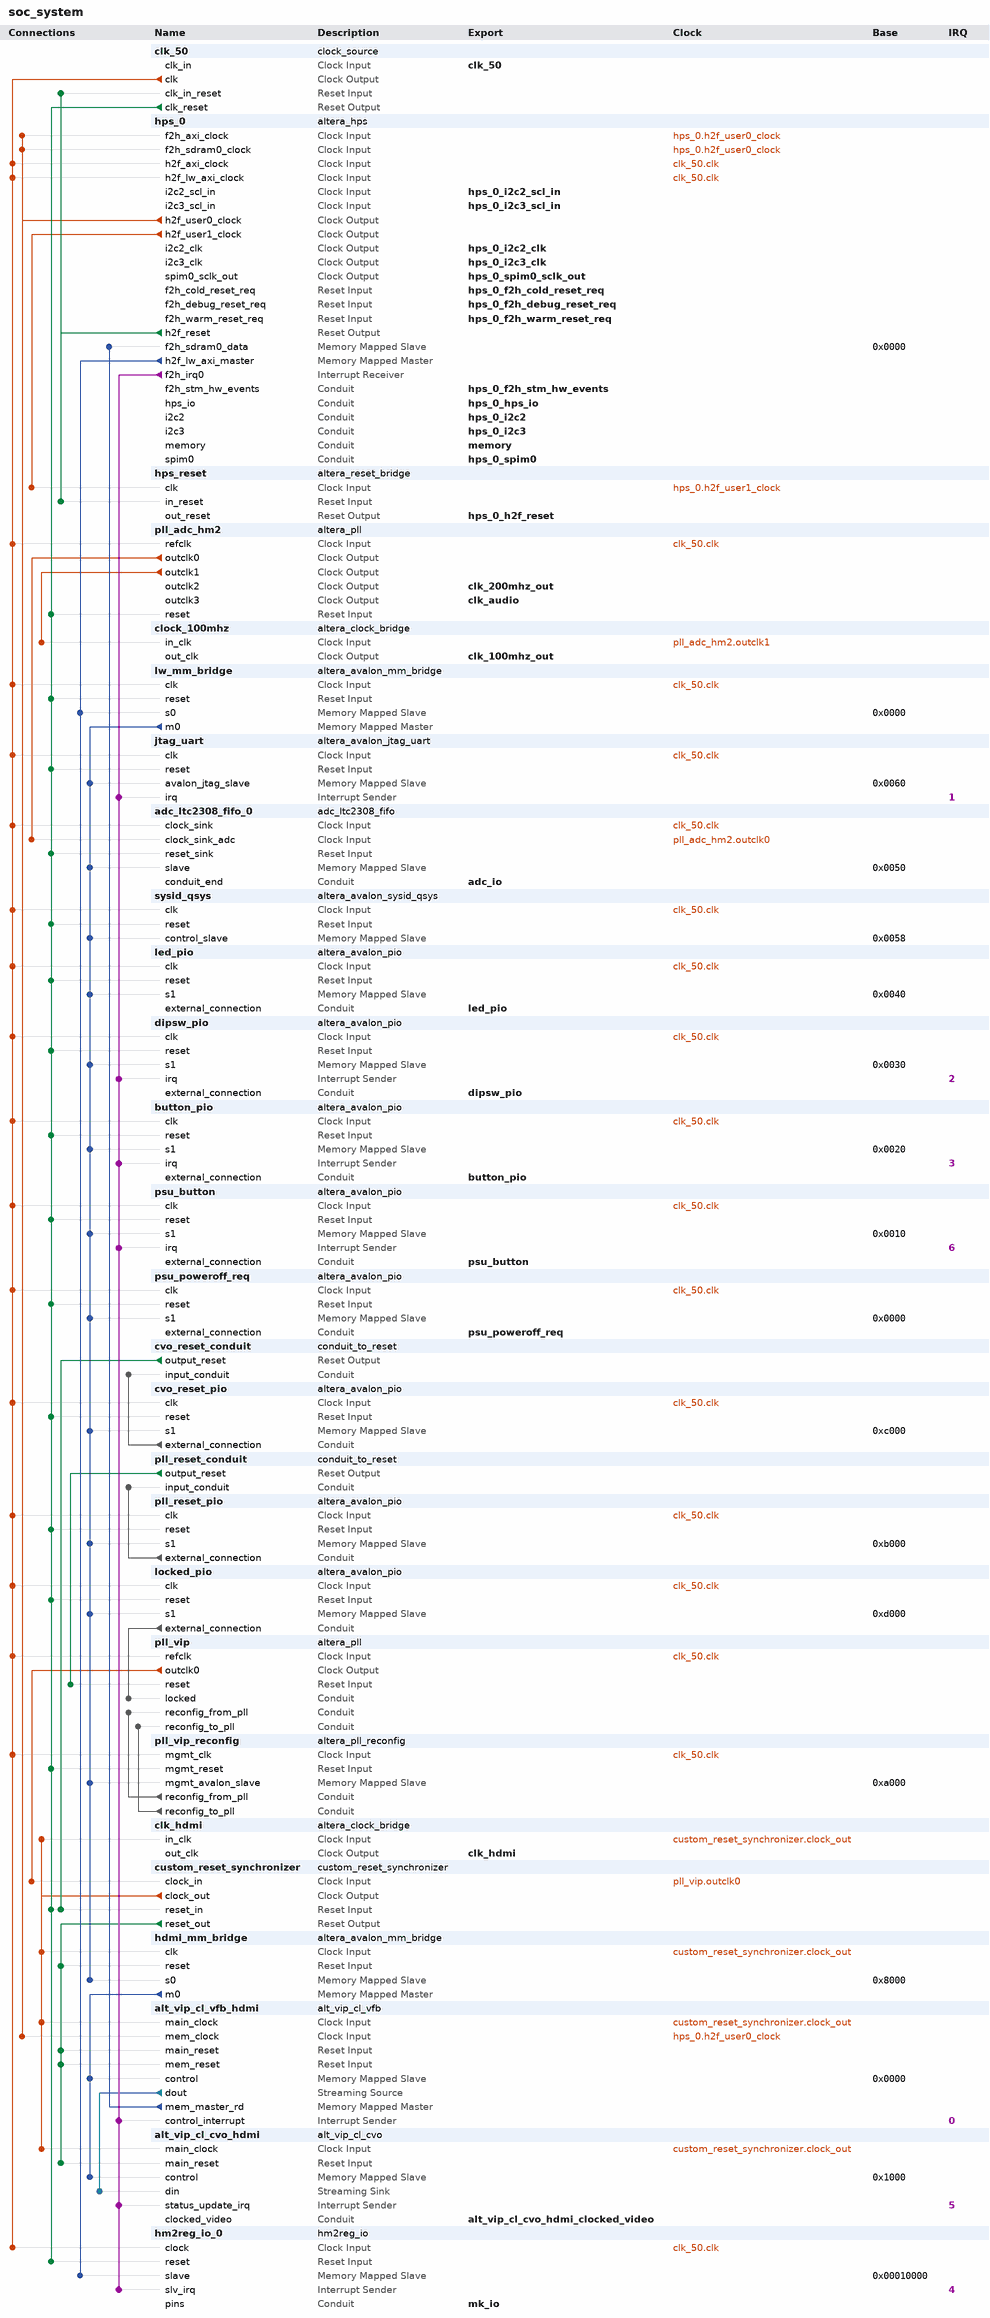
[diagram p0: system contents]
# Platform Designer (Qsys) system soc_system, Cyclone V 5CSEBA6U23I7
# Parameters at their usual value, and those the tool derives, are not listed.
package require -exact qsys 18.1
create_system soc_system
set_project_property DEVICE_FAMILY {Cyclone V}
set_project_property DEVICE 5CSEBA6U23I7

add_instance clk_50 clock_source 18.1
set_instance_parameter_value clk_50 clockFrequency 50000000

add_instance hps_0 altera_hps 18.1
set_instance_parameter_value hps_0 EMAC1_Mode RGMII
set_instance_parameter_value hps_0 EMAC1_PinMuxing {HPS I/O Set 0}
set_instance_parameter_value hps_0 F2SCLK_COLDRST_Enable true
set_instance_parameter_value hps_0 F2SCLK_DBGRST_Enable true
set_instance_parameter_value hps_0 F2SCLK_WARMRST_Enable true
set_instance_parameter_value hps_0 F2SDRAM_Type {Avalon-MM Bidirectional}
set_instance_parameter_value hps_0 F2SDRAM_Width 256
set_instance_parameter_value hps_0 F2SINTERRUPT_Enable true
set_instance_parameter_value hps_0 F2S_Width 3
set_instance_parameter_value hps_0 FPGA_PERIPHERAL_OUTPUT_CLOCK_FREQ_EMAC0_GTX_CLK 100
set_instance_parameter_value hps_0 FPGA_PERIPHERAL_OUTPUT_CLOCK_FREQ_EMAC0_MD_CLK 100.0
set_instance_parameter_value hps_0 FPGA_PERIPHERAL_OUTPUT_CLOCK_FREQ_EMAC1_GTX_CLK 100
set_instance_parameter_value hps_0 FPGA_PERIPHERAL_OUTPUT_CLOCK_FREQ_EMAC1_MD_CLK 100.0
set_instance_parameter_value hps_0 HPS_PROTOCOL DDR3
set_instance_parameter_value hps_0 I2C0_Mode I2C
set_instance_parameter_value hps_0 I2C0_PinMuxing {HPS I/O Set 0}
set_instance_parameter_value hps_0 I2C1_Mode I2C
set_instance_parameter_value hps_0 I2C1_PinMuxing {HPS I/O Set 0}
set_instance_parameter_value hps_0 I2C2_Mode Full
set_instance_parameter_value hps_0 I2C2_PinMuxing FPGA
set_instance_parameter_value hps_0 I2C3_Mode Full
set_instance_parameter_value hps_0 I2C3_PinMuxing FPGA
set_instance_parameter_value hps_0 LWH2F_Enable true
set_instance_parameter_value hps_0 MEM_BANKADDR_WIDTH 3
set_instance_parameter_value hps_0 MEM_CLK_FREQ 400.0
set_instance_parameter_value hps_0 MEM_COL_ADDR_WIDTH 10
set_instance_parameter_value hps_0 MEM_DQ_WIDTH 32
set_instance_parameter_value hps_0 MEM_DRV_STR RZQ/6
set_instance_parameter_value hps_0 MEM_ROW_ADDR_WIDTH 15
set_instance_parameter_value hps_0 MEM_RTT_NOM RZQ/6
set_instance_parameter_value hps_0 MEM_RTT_WR {Dynamic ODT off}
set_instance_parameter_value hps_0 MEM_TCL 7
set_instance_parameter_value hps_0 MEM_TFAW_NS 37.5
set_instance_parameter_value hps_0 MEM_TRAS_NS 35.0
set_instance_parameter_value hps_0 MEM_TRCD_NS 13.75
set_instance_parameter_value hps_0 MEM_TRFC_NS 300.0
set_instance_parameter_value hps_0 MEM_TRP_NS 13.75
set_instance_parameter_value hps_0 MEM_VENDOR Other
set_instance_parameter_value hps_0 MEM_WTCL 7
set_instance_parameter_value hps_0 QSPI_Mode N/A
set_instance_parameter_value hps_0 QSPI_PinMuxing Unused
set_instance_parameter_value hps_0 REF_CLK_FREQ 25.0
set_instance_parameter_value hps_0 S2FCLK_USER0CLK_Enable true
set_instance_parameter_value hps_0 S2FCLK_USER1CLK_Enable true
set_instance_parameter_value hps_0 S2FCLK_USER1CLK_FREQ 50.0
set_instance_parameter_value hps_0 S2FCLK_USER2CLK 5
set_instance_parameter_value hps_0 S2F_Width 2
set_instance_parameter_value hps_0 SDIO_Mode {4-bit Data}
set_instance_parameter_value hps_0 SDIO_PinMuxing {HPS I/O Set 0}
set_instance_parameter_value hps_0 SPIM0_Mode Full
set_instance_parameter_value hps_0 SPIM0_PinMuxing FPGA
set_instance_parameter_value hps_0 SPIM1_Mode {Single Slave Select}
set_instance_parameter_value hps_0 SPIM1_PinMuxing {HPS I/O Set 0}
set_instance_parameter_value hps_0 STM_Enable true
set_instance_parameter_value hps_0 TIMING_BOARD_AC_SKEW 0.02
set_instance_parameter_value hps_0 TIMING_BOARD_AC_TO_CK_SKEW 0.0
set_instance_parameter_value hps_0 TIMING_BOARD_DQ_TO_DQS_SKEW 0.0
set_instance_parameter_value hps_0 TIMING_BOARD_MAX_CK_DELAY 0.6
set_instance_parameter_value hps_0 TIMING_BOARD_MAX_DQS_DELAY 0.6
set_instance_parameter_value hps_0 TIMING_BOARD_SKEW_BETWEEN_DQS 0.02
set_instance_parameter_value hps_0 TIMING_BOARD_SKEW_CKDQS_DIMM_MAX 0.01
set_instance_parameter_value hps_0 TIMING_BOARD_SKEW_CKDQS_DIMM_MIN -0.01
set_instance_parameter_value hps_0 TIMING_BOARD_SKEW_WITHIN_DQS 0.02
set_instance_parameter_value hps_0 TIMING_TDH 125
set_instance_parameter_value hps_0 TIMING_TDQSCK 400
set_instance_parameter_value hps_0 TIMING_TDQSQ 120
set_instance_parameter_value hps_0 TIMING_TDS 50
set_instance_parameter_value hps_0 TIMING_TIH 250
set_instance_parameter_value hps_0 TIMING_TIS 175
set_instance_parameter_value hps_0 TIMING_TQSH 0.38
set_instance_parameter_value hps_0 UART0_Mode {No Flow Control}
set_instance_parameter_value hps_0 UART0_PinMuxing {HPS I/O Set 0}
set_instance_parameter_value hps_0 USB1_Mode SDR
set_instance_parameter_value hps_0 USB1_PinMuxing {HPS I/O Set 0}
set_instance_parameter_value hps_0 desired_cfg_clk_mhz 100.0
set_instance_parameter_value hps_0 desired_qspi_clk_mhz 370.0

add_instance hps_reset altera_reset_bridge 18.1
set_instance_parameter_value hps_reset ACTIVE_LOW_RESET 1
set_instance_parameter_value hps_reset SYNCHRONOUS_EDGES deassert

add_instance pll_adc_hm2 altera_pll 18.1
set_instance_parameter_value pll_adc_hm2 gui_device_speed_grade 2
set_instance_parameter_value pll_adc_hm2 gui_number_of_clocks 4
set_instance_parameter_value pll_adc_hm2 gui_operation_mode direct
set_instance_parameter_value pll_adc_hm2 gui_output_clock_frequency0 40.0
set_instance_parameter_value pll_adc_hm2 gui_output_clock_frequency1 100.0
set_instance_parameter_value pll_adc_hm2 gui_output_clock_frequency2 200.0
set_instance_parameter_value pll_adc_hm2 gui_output_clock_frequency3 1.534526
set_instance_parameter_value pll_adc_hm2 gui_pll_mode {Integer-N PLL}
set_instance_parameter_value pll_adc_hm2 gui_reference_clock_frequency 50.0
set_instance_parameter_value pll_adc_hm2 gui_use_locked false

add_instance clock_100mhz altera_clock_bridge 18.1
set_instance_parameter_value clock_100mhz DERIVED_CLOCK_RATE 100000000
set_instance_parameter_value clock_100mhz EXPLICIT_CLOCK_RATE 100000000

add_instance lw_mm_bridge altera_avalon_mm_bridge 18.1
set_instance_parameter_value lw_mm_bridge ADDRESS_UNITS SYMBOLS
set_instance_parameter_value lw_mm_bridge ADDRESS_WIDTH 19
set_instance_parameter_value lw_mm_bridge DATA_WIDTH 32
set_instance_parameter_value lw_mm_bridge MAX_PENDING_RESPONSES 4
set_instance_parameter_value lw_mm_bridge USE_AUTO_ADDRESS_WIDTH 1

add_instance jtag_uart altera_avalon_jtag_uart 18.1
set_instance_parameter_value jtag_uart allowMultipleConnections true
set_instance_parameter_value jtag_uart simInteractiveOptions INTERACTIVE_ASCII_OUTPUT

add_instance adc_ltc2308_fifo_0 adc_ltc2308_fifo 1.1

add_instance sysid_qsys altera_avalon_sysid_qsys 18.1
set_instance_parameter_value sysid_qsys id -1395321854

add_instance led_pio altera_avalon_pio 18.1
set_instance_parameter_value led_pio direction Output
set_instance_parameter_value led_pio width 7

add_instance dipsw_pio altera_avalon_pio 18.1
set_instance_parameter_value dipsw_pio bitClearingEdgeCapReg true
set_instance_parameter_value dipsw_pio captureEdge true
set_instance_parameter_value dipsw_pio direction Input
set_instance_parameter_value dipsw_pio edgeType ANY
set_instance_parameter_value dipsw_pio generateIRQ true
set_instance_parameter_value dipsw_pio irqType EDGE
set_instance_parameter_value dipsw_pio width 4

add_instance button_pio altera_avalon_pio 18.1
set_instance_parameter_value button_pio bitClearingEdgeCapReg true
set_instance_parameter_value button_pio captureEdge true
set_instance_parameter_value button_pio direction Input
set_instance_parameter_value button_pio edgeType FALLING
set_instance_parameter_value button_pio generateIRQ true
set_instance_parameter_value button_pio irqType EDGE
set_instance_parameter_value button_pio width 2

add_instance psu_button altera_avalon_pio 18.1
set_instance_parameter_value psu_button direction Input
set_instance_parameter_value psu_button generateIRQ true
set_instance_parameter_value psu_button width 1

add_instance psu_poweroff_req altera_avalon_pio 18.1
set_instance_parameter_value psu_poweroff_req direction Output
set_instance_parameter_value psu_poweroff_req width 1

add_instance cvo_reset_conduit conduit_to_reset 1.0
set_instance_parameter_value cvo_reset_conduit INPUT_CONDUIT_ROLE export

add_instance cvo_reset_pio altera_avalon_pio 18.1
set_instance_parameter_value cvo_reset_pio bitModifyingOutReg true
set_instance_parameter_value cvo_reset_pio direction Output
set_instance_parameter_value cvo_reset_pio width 1

add_instance pll_reset_conduit conduit_to_reset 1.0
set_instance_parameter_value pll_reset_conduit INPUT_CONDUIT_ROLE export

add_instance pll_reset_pio altera_avalon_pio 18.1
set_instance_parameter_value pll_reset_pio bitModifyingOutReg true
set_instance_parameter_value pll_reset_pio direction Output
set_instance_parameter_value pll_reset_pio width 1

add_instance locked_pio altera_avalon_pio 18.1
set_instance_parameter_value locked_pio bitModifyingOutReg true
set_instance_parameter_value locked_pio direction Input
set_instance_parameter_value locked_pio width 1

add_instance pll_vip altera_pll 18.1
set_instance_parameter_value pll_vip gui_device_speed_grade 2
set_instance_parameter_value pll_vip gui_en_reconf true
set_instance_parameter_value pll_vip gui_number_of_clocks 1
set_instance_parameter_value pll_vip gui_operation_mode direct
set_instance_parameter_value pll_vip gui_output_clock_frequency0 148.5
set_instance_parameter_value pll_vip gui_pll_mode {Fractional-N PLL}
set_instance_parameter_value pll_vip gui_reference_clock_frequency 50.0
set_instance_parameter_value pll_vip gui_use_locked true

add_instance pll_vip_reconfig altera_pll_reconfig 18.1
set_instance_parameter_value pll_vip_reconfig ENABLE_BYTEENABLE true

add_instance clk_hdmi altera_clock_bridge 18.1
set_instance_parameter_value clk_hdmi DERIVED_CLOCK_RATE 148500000
set_instance_parameter_value clk_hdmi EXPLICIT_CLOCK_RATE 0

add_instance custom_reset_synchronizer custom_reset_synchronizer 16.1
set_instance_parameter_value custom_reset_synchronizer ADDITIONAL_DEPTH 2
set_instance_parameter_value custom_reset_synchronizer DERIVED_CLOCK_RATE 148500000
set_instance_parameter_value custom_reset_synchronizer DISABLE_GLOBAL_NETWORK 1
set_instance_parameter_value custom_reset_synchronizer INPUT_CLOCK_FREQUENCY 148500000
set_instance_parameter_value custom_reset_synchronizer INPUT_CLOCK_KNOWN 1
set_instance_parameter_value custom_reset_synchronizer SYNC_BOTH_EDGES 0
set_instance_parameter_value custom_reset_synchronizer SYNC_DEPTH 3

add_instance hdmi_mm_bridge altera_avalon_mm_bridge 18.1
set_instance_parameter_value hdmi_mm_bridge ADDRESS_UNITS SYMBOLS
set_instance_parameter_value hdmi_mm_bridge ADDRESS_WIDTH 10
set_instance_parameter_value hdmi_mm_bridge DATA_WIDTH 32
set_instance_parameter_value hdmi_mm_bridge MAX_PENDING_RESPONSES 4
set_instance_parameter_value hdmi_mm_bridge USE_AUTO_ADDRESS_WIDTH 1

add_instance alt_vip_cl_vfb_hdmi alt_vip_cl_vfb 18.1
set_instance_parameter_value alt_vip_cl_vfb_hdmi CLOCKS_ARE_SEPARATE 1
set_instance_parameter_value alt_vip_cl_vfb_hdmi DROP_FRAMES 0
set_instance_parameter_value alt_vip_cl_vfb_hdmi DROP_REPEAT_USER 0
set_instance_parameter_value alt_vip_cl_vfb_hdmi IS_FRAME_READER 1
set_instance_parameter_value alt_vip_cl_vfb_hdmi LINE_BASED_BUFFERING 0
set_instance_parameter_value alt_vip_cl_vfb_hdmi MAX_HEIGHT 1080
set_instance_parameter_value alt_vip_cl_vfb_hdmi MAX_WIDTH 1920
set_instance_parameter_value alt_vip_cl_vfb_hdmi MEM_BASE_ADDR 0
set_instance_parameter_value alt_vip_cl_vfb_hdmi MEM_BUFFER_OFFSET 16777216
set_instance_parameter_value alt_vip_cl_vfb_hdmi MEM_PORT_WIDTH 256
set_instance_parameter_value alt_vip_cl_vfb_hdmi NUMBER_OF_COLOR_PLANES 4
set_instance_parameter_value alt_vip_cl_vfb_hdmi PRIORITIZE_FMAX 0
set_instance_parameter_value alt_vip_cl_vfb_hdmi READER_RUNTIME_CONTROL 1
set_instance_parameter_value alt_vip_cl_vfb_hdmi READ_FIFO_DEPTH 256
set_instance_parameter_value alt_vip_cl_vfb_hdmi USER_PACKETS_MAX_STORAGE 0
set_instance_parameter_value alt_vip_cl_vfb_hdmi USE_BUFFER_OFFSET 0
set_instance_parameter_value alt_vip_cl_vfb_hdmi WRITE_BURST_TARGET 2
set_instance_parameter_value alt_vip_cl_vfb_hdmi WRITE_FIFO_DEPTH 8

add_instance alt_vip_cl_cvo_hdmi alt_vip_cl_cvo 18.1
set_instance_parameter_value alt_vip_cl_cvo_hdmi ACCEPT_COLOURS_IN_SEQ 0
set_instance_parameter_value alt_vip_cl_cvo_hdmi ACCEPT_SYNC 0
set_instance_parameter_value alt_vip_cl_cvo_hdmi ANC_LINE 0
set_instance_parameter_value alt_vip_cl_cvo_hdmi AP_LINE 0
set_instance_parameter_value alt_vip_cl_cvo_hdmi BPS 8
set_instance_parameter_value alt_vip_cl_cvo_hdmi CLOCKS_ARE_SAME 0
set_instance_parameter_value alt_vip_cl_cvo_hdmi COLOUR_PLANES_ARE_IN_PARALLEL 1
set_instance_parameter_value alt_vip_cl_cvo_hdmi CONTEXT_WIDTH 8
set_instance_parameter_value alt_vip_cl_cvo_hdmi COUNT_STEP_IS_PIP_VALUE 0
set_instance_parameter_value alt_vip_cl_cvo_hdmi DST_WIDTH 8
set_instance_parameter_value alt_vip_cl_cvo_hdmi FIELD0_ANC_LINE 0
set_instance_parameter_value alt_vip_cl_cvo_hdmi FIELD0_V_BACK_PORCH 0
set_instance_parameter_value alt_vip_cl_cvo_hdmi FIELD0_V_BLANK 0
set_instance_parameter_value alt_vip_cl_cvo_hdmi FIELD0_V_FRONT_PORCH 0
set_instance_parameter_value alt_vip_cl_cvo_hdmi FIELD0_V_RISING_EDGE 0
set_instance_parameter_value alt_vip_cl_cvo_hdmi FIELD0_V_SYNC_LENGTH 0
set_instance_parameter_value alt_vip_cl_cvo_hdmi FIFO_DEPTH 1920
set_instance_parameter_value alt_vip_cl_cvo_hdmi F_FALLING_EDGE 0
set_instance_parameter_value alt_vip_cl_cvo_hdmi F_RISING_EDGE 0
set_instance_parameter_value alt_vip_cl_cvo_hdmi GENERATE_SYNC 0
set_instance_parameter_value alt_vip_cl_cvo_hdmi H_ACTIVE_PIXELS 1920
set_instance_parameter_value alt_vip_cl_cvo_hdmi H_BACK_PORCH 64
set_instance_parameter_value alt_vip_cl_cvo_hdmi H_BLANK 0
set_instance_parameter_value alt_vip_cl_cvo_hdmi H_FRONT_PORCH 32
set_instance_parameter_value alt_vip_cl_cvo_hdmi H_SYNC_LENGTH 32
set_instance_parameter_value alt_vip_cl_cvo_hdmi INTERLACED 0
set_instance_parameter_value alt_vip_cl_cvo_hdmi LOW_LATENCY 0
set_instance_parameter_value alt_vip_cl_cvo_hdmi NO_OF_CHANNELS 1
set_instance_parameter_value alt_vip_cl_cvo_hdmi NO_OF_MODES 1
set_instance_parameter_value alt_vip_cl_cvo_hdmi NUMBER_OF_COLOUR_PLANES 4
set_instance_parameter_value alt_vip_cl_cvo_hdmi PIXELS_IN_PARALLEL 1
set_instance_parameter_value alt_vip_cl_cvo_hdmi SRC_WIDTH 8
set_instance_parameter_value alt_vip_cl_cvo_hdmi STD_WIDTH 1
set_instance_parameter_value alt_vip_cl_cvo_hdmi TASK_WIDTH 8
set_instance_parameter_value alt_vip_cl_cvo_hdmi THRESHOLD 1919
set_instance_parameter_value alt_vip_cl_cvo_hdmi USE_CONTROL 1
set_instance_parameter_value alt_vip_cl_cvo_hdmi USE_EMBEDDED_SYNCS 0
set_instance_parameter_value alt_vip_cl_cvo_hdmi V_ACTIVE_LINES 1080
set_instance_parameter_value alt_vip_cl_cvo_hdmi V_BACK_PORCH 27
set_instance_parameter_value alt_vip_cl_cvo_hdmi V_BLANK 0
set_instance_parameter_value alt_vip_cl_cvo_hdmi V_FRONT_PORCH 1
set_instance_parameter_value alt_vip_cl_cvo_hdmi V_SYNC_LENGTH 3

add_instance hm2reg_io_0 hm2reg_io 1.0
set_instance_parameter_value hm2reg_io_0 ADDRESS_WIDTH 14
set_instance_parameter_value hm2reg_io_0 DATA_WIDTH 32
set_instance_parameter_value hm2reg_io_0 IRQ_EN 1

# connections
add_connection clk_50.clk adc_ltc2308_fifo_0.clock_sink clock
add_connection clk_50.clk button_pio.clk clock
add_connection clk_50.clk cvo_reset_pio.clk clock
add_connection clk_50.clk dipsw_pio.clk clock
add_connection clk_50.clk hm2reg_io_0.clock clock
add_connection clk_50.clk hps_0.h2f_axi_clock clock
add_connection clk_50.clk hps_0.h2f_lw_axi_clock clock
add_connection clk_50.clk jtag_uart.clk clock
add_connection clk_50.clk led_pio.clk clock
add_connection clk_50.clk locked_pio.clk clock
add_connection clk_50.clk lw_mm_bridge.clk clock
add_connection clk_50.clk pll_adc_hm2.refclk clock
add_connection clk_50.clk pll_reset_pio.clk clock
add_connection clk_50.clk pll_vip.refclk clock
add_connection clk_50.clk pll_vip_reconfig.mgmt_clk clock
add_connection clk_50.clk psu_button.clk clock
add_connection clk_50.clk psu_poweroff_req.clk clock
add_connection clk_50.clk sysid_qsys.clk clock
add_connection custom_reset_synchronizer.clock_out alt_vip_cl_cvo_hdmi.main_clock clock
add_connection custom_reset_synchronizer.clock_out alt_vip_cl_vfb_hdmi.main_clock clock
add_connection custom_reset_synchronizer.clock_out clk_hdmi.in_clk clock
add_connection custom_reset_synchronizer.clock_out hdmi_mm_bridge.clk clock
add_connection hps_0.h2f_user0_clock alt_vip_cl_vfb_hdmi.mem_clock clock
add_connection hps_0.h2f_user0_clock hps_0.f2h_axi_clock clock
add_connection hps_0.h2f_user0_clock hps_0.f2h_sdram0_clock clock
add_connection hps_0.h2f_user1_clock hps_reset.clk clock
add_connection pll_adc_hm2.outclk0 adc_ltc2308_fifo_0.clock_sink_adc clock
add_connection pll_adc_hm2.outclk1 clock_100mhz.in_clk clock
add_connection pll_vip.outclk0 custom_reset_synchronizer.clock_in clock
add_connection clk_50.clk_reset adc_ltc2308_fifo_0.reset_sink reset
add_connection clk_50.clk_reset button_pio.reset reset
add_connection clk_50.clk_reset custom_reset_synchronizer.reset_in reset
add_connection clk_50.clk_reset cvo_reset_pio.reset reset
add_connection clk_50.clk_reset dipsw_pio.reset reset
add_connection clk_50.clk_reset hm2reg_io_0.reset reset
add_connection clk_50.clk_reset jtag_uart.reset reset
add_connection clk_50.clk_reset led_pio.reset reset
add_connection clk_50.clk_reset locked_pio.reset reset
add_connection clk_50.clk_reset lw_mm_bridge.reset reset
add_connection clk_50.clk_reset pll_adc_hm2.reset reset
add_connection clk_50.clk_reset pll_reset_pio.reset reset
add_connection clk_50.clk_reset pll_vip_reconfig.mgmt_reset reset
add_connection clk_50.clk_reset psu_button.reset reset
add_connection clk_50.clk_reset psu_poweroff_req.reset reset
add_connection clk_50.clk_reset sysid_qsys.reset reset
add_connection custom_reset_synchronizer.reset_out alt_vip_cl_cvo_hdmi.main_reset reset
add_connection custom_reset_synchronizer.reset_out alt_vip_cl_vfb_hdmi.main_reset reset
add_connection custom_reset_synchronizer.reset_out alt_vip_cl_vfb_hdmi.mem_reset reset
add_connection custom_reset_synchronizer.reset_out hdmi_mm_bridge.reset reset
add_connection cvo_reset_conduit.output_reset custom_reset_synchronizer.reset_in reset
add_connection hps_0.h2f_reset clk_50.clk_in_reset reset
add_connection hps_0.h2f_reset hps_reset.in_reset reset
add_connection pll_reset_conduit.output_reset pll_vip.reset reset
add_connection alt_vip_cl_vfb_hdmi.mem_master_rd hps_0.f2h_sdram0_data avalon
set_connection_parameter_value alt_vip_cl_vfb_hdmi.mem_master_rd/hps_0.f2h_sdram0_data baseAddress 0x0000
add_connection hdmi_mm_bridge.m0 alt_vip_cl_cvo_hdmi.control avalon
set_connection_parameter_value hdmi_mm_bridge.m0/alt_vip_cl_cvo_hdmi.control baseAddress 0x1000
add_connection hdmi_mm_bridge.m0 alt_vip_cl_vfb_hdmi.control avalon
set_connection_parameter_value hdmi_mm_bridge.m0/alt_vip_cl_vfb_hdmi.control baseAddress 0x0000
add_connection hps_0.h2f_lw_axi_master hm2reg_io_0.slave avalon
set_connection_parameter_value hps_0.h2f_lw_axi_master/hm2reg_io_0.slave baseAddress 0x00010000
add_connection hps_0.h2f_lw_axi_master lw_mm_bridge.s0 avalon
set_connection_parameter_value hps_0.h2f_lw_axi_master/lw_mm_bridge.s0 baseAddress 0x0000
add_connection lw_mm_bridge.m0 adc_ltc2308_fifo_0.slave avalon
set_connection_parameter_value lw_mm_bridge.m0/adc_ltc2308_fifo_0.slave baseAddress 0x0050
add_connection lw_mm_bridge.m0 button_pio.s1 avalon
set_connection_parameter_value lw_mm_bridge.m0/button_pio.s1 baseAddress 0x0020
add_connection lw_mm_bridge.m0 cvo_reset_pio.s1 avalon
set_connection_parameter_value lw_mm_bridge.m0/cvo_reset_pio.s1 baseAddress 0xc000
add_connection lw_mm_bridge.m0 dipsw_pio.s1 avalon
set_connection_parameter_value lw_mm_bridge.m0/dipsw_pio.s1 baseAddress 0x0030
add_connection lw_mm_bridge.m0 hdmi_mm_bridge.s0 avalon
set_connection_parameter_value lw_mm_bridge.m0/hdmi_mm_bridge.s0 baseAddress 0x8000
add_connection lw_mm_bridge.m0 jtag_uart.avalon_jtag_slave avalon
set_connection_parameter_value lw_mm_bridge.m0/jtag_uart.avalon_jtag_slave baseAddress 0x0060
add_connection lw_mm_bridge.m0 led_pio.s1 avalon
set_connection_parameter_value lw_mm_bridge.m0/led_pio.s1 baseAddress 0x0040
add_connection lw_mm_bridge.m0 locked_pio.s1 avalon
set_connection_parameter_value lw_mm_bridge.m0/locked_pio.s1 baseAddress 0xd000
add_connection lw_mm_bridge.m0 pll_reset_pio.s1 avalon
set_connection_parameter_value lw_mm_bridge.m0/pll_reset_pio.s1 baseAddress 0xb000
add_connection lw_mm_bridge.m0 pll_vip_reconfig.mgmt_avalon_slave avalon
set_connection_parameter_value lw_mm_bridge.m0/pll_vip_reconfig.mgmt_avalon_slave baseAddress 0xa000
add_connection lw_mm_bridge.m0 psu_button.s1 avalon
set_connection_parameter_value lw_mm_bridge.m0/psu_button.s1 baseAddress 0x0010
add_connection lw_mm_bridge.m0 psu_poweroff_req.s1 avalon
set_connection_parameter_value lw_mm_bridge.m0/psu_poweroff_req.s1 baseAddress 0x0000
add_connection lw_mm_bridge.m0 sysid_qsys.control_slave avalon
set_connection_parameter_value lw_mm_bridge.m0/sysid_qsys.control_slave baseAddress 0x0058
add_connection alt_vip_cl_vfb_hdmi.dout alt_vip_cl_cvo_hdmi.din avalon_streaming
add_connection cvo_reset_pio.external_connection cvo_reset_conduit.input_conduit conduit
add_connection locked_pio.external_connection pll_vip.locked conduit
add_connection pll_reset_pio.external_connection pll_reset_conduit.input_conduit conduit
add_connection pll_vip_reconfig.reconfig_from_pll pll_vip.reconfig_from_pll conduit
add_connection pll_vip_reconfig.reconfig_to_pll pll_vip.reconfig_to_pll conduit
add_connection hps_0.f2h_irq0 alt_vip_cl_cvo_hdmi.status_update_irq interrupt
set_connection_parameter_value hps_0.f2h_irq0/alt_vip_cl_cvo_hdmi.status_update_irq irqNumber 5
add_connection hps_0.f2h_irq0 alt_vip_cl_vfb_hdmi.control_interrupt interrupt
set_connection_parameter_value hps_0.f2h_irq0/alt_vip_cl_vfb_hdmi.control_interrupt irqNumber 0
add_connection hps_0.f2h_irq0 button_pio.irq interrupt
set_connection_parameter_value hps_0.f2h_irq0/button_pio.irq irqNumber 3
add_connection hps_0.f2h_irq0 dipsw_pio.irq interrupt
set_connection_parameter_value hps_0.f2h_irq0/dipsw_pio.irq irqNumber 2
add_connection hps_0.f2h_irq0 hm2reg_io_0.slv_irq interrupt
set_connection_parameter_value hps_0.f2h_irq0/hm2reg_io_0.slv_irq irqNumber 4
add_connection hps_0.f2h_irq0 jtag_uart.irq interrupt
set_connection_parameter_value hps_0.f2h_irq0/jtag_uart.irq irqNumber 1
add_connection hps_0.f2h_irq0 psu_button.irq interrupt
set_connection_parameter_value hps_0.f2h_irq0/psu_button.irq irqNumber 6

# exported interfaces
add_interface adc_io conduit end
set_interface_property adc_io EXPORT_OF adc_ltc2308_fifo_0.conduit_end
add_interface alt_vip_cl_cvo_hdmi_clocked_video conduit end
set_interface_property alt_vip_cl_cvo_hdmi_clocked_video EXPORT_OF alt_vip_cl_cvo_hdmi.clocked_video
add_interface button_pio conduit end
set_interface_property button_pio EXPORT_OF button_pio.external_connection
add_interface clk_100mhz_out clock source
set_interface_property clk_100mhz_out EXPORT_OF clock_100mhz.out_clk
add_interface clk_200mhz_out clock source
set_interface_property clk_200mhz_out EXPORT_OF pll_adc_hm2.outclk2
add_interface clk_50 clock sink
set_interface_property clk_50 EXPORT_OF clk_50.clk_in
add_interface clk_audio clock source
set_interface_property clk_audio EXPORT_OF pll_adc_hm2.outclk3
add_interface clk_hdmi clock source
set_interface_property clk_hdmi EXPORT_OF clk_hdmi.out_clk
add_interface dipsw_pio conduit end
set_interface_property dipsw_pio EXPORT_OF dipsw_pio.external_connection
add_interface hps_0_f2h_cold_reset_req reset sink
set_interface_property hps_0_f2h_cold_reset_req EXPORT_OF hps_0.f2h_cold_reset_req
add_interface hps_0_f2h_debug_reset_req reset sink
set_interface_property hps_0_f2h_debug_reset_req EXPORT_OF hps_0.f2h_debug_reset_req
add_interface hps_0_f2h_stm_hw_events conduit end
set_interface_property hps_0_f2h_stm_hw_events EXPORT_OF hps_0.f2h_stm_hw_events
add_interface hps_0_f2h_warm_reset_req reset sink
set_interface_property hps_0_f2h_warm_reset_req EXPORT_OF hps_0.f2h_warm_reset_req
add_interface hps_0_h2f_reset reset source
set_interface_property hps_0_h2f_reset EXPORT_OF hps_reset.out_reset
add_interface hps_0_hps_io conduit end
set_interface_property hps_0_hps_io EXPORT_OF hps_0.hps_io
add_interface hps_0_i2c2 conduit end
set_interface_property hps_0_i2c2 EXPORT_OF hps_0.i2c2
add_interface hps_0_i2c2_clk clock source
set_interface_property hps_0_i2c2_clk EXPORT_OF hps_0.i2c2_clk
add_interface hps_0_i2c2_scl_in clock sink
set_interface_property hps_0_i2c2_scl_in EXPORT_OF hps_0.i2c2_scl_in
add_interface hps_0_i2c3 conduit end
set_interface_property hps_0_i2c3 EXPORT_OF hps_0.i2c3
add_interface hps_0_i2c3_clk clock source
set_interface_property hps_0_i2c3_clk EXPORT_OF hps_0.i2c3_clk
add_interface hps_0_i2c3_scl_in clock sink
set_interface_property hps_0_i2c3_scl_in EXPORT_OF hps_0.i2c3_scl_in
add_interface hps_0_spim0 conduit end
set_interface_property hps_0_spim0 EXPORT_OF hps_0.spim0
add_interface hps_0_spim0_sclk_out clock source
set_interface_property hps_0_spim0_sclk_out EXPORT_OF hps_0.spim0_sclk_out
add_interface led_pio conduit end
set_interface_property led_pio EXPORT_OF led_pio.external_connection
add_interface memory conduit end
set_interface_property memory EXPORT_OF hps_0.memory
add_interface mk_io conduit end
set_interface_property mk_io EXPORT_OF hm2reg_io_0.pins
add_interface psu_button conduit end
set_interface_property psu_button EXPORT_OF psu_button.external_connection
add_interface psu_poweroff_req conduit end
set_interface_property psu_poweroff_req EXPORT_OF psu_poweroff_req.external_connection

set_interconnect_requirement {$system} qsys_mm.clockCrossingAdapter HANDSHAKE
set_interconnect_requirement {$system} qsys_mm.enableEccProtection FALSE
set_interconnect_requirement {$system} qsys_mm.insertDefaultSlave FALSE
set_interconnect_requirement {$system} qsys_mm.maxAdditionalLatency 0

save_system soc_system.qsys
